# Altium project routed.PrjPcb
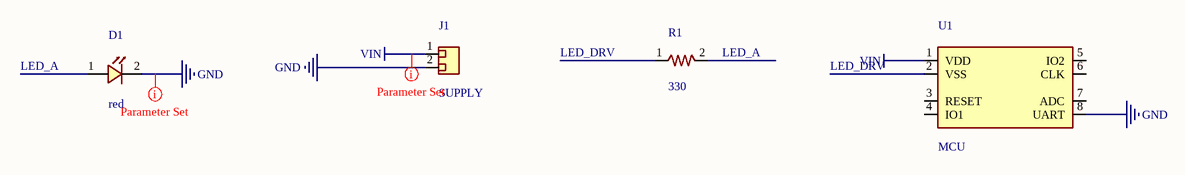
[diagram p0: routed.SchDoc]
1 sheet, 4 parts. Net scope: global (net labels, ports and power ports of the same name join across sheets).
Board file: routed.PcbDoc

## Sheet routed.SchDoc
size A4

### Parts
D1  red  [LED0603_Kingbright_APT1608SURCK]
J1  SUPPLY  [Header_1x2_P2.54]
R1  330  [Chip_0603]
U1  MCU  [DIP8_Microchip_P]

### Nets
GND: D1.2(K) J1.2(Passive) U1.8(UART)
VIN: J1.1(Passive) U1.1(VDD)
LED_A: D1.1(A) R1.2(B)
LED_DRV: R1.1(A) U1.2(VSS)

Not connected (* = marked no-connect by the designer): U1 3(RESET) 4(IO1) 5(IO2) 6(CLK) 7(ADC)

### Layout directives
net class PWR: GND, VIN

### Library data of the parts
D1 = LED: pin to pad: 1>2 2>1
J1 = Connector_2
R1 = Resistor
U1 = Microcontroller